# Altium schematic sheet Scratch_Register_16B.SchDoc
size B; Author: E. Sims; Organization: Let's Build Rockets Inc.; SheetNumber: 2; SheetTotal: 2
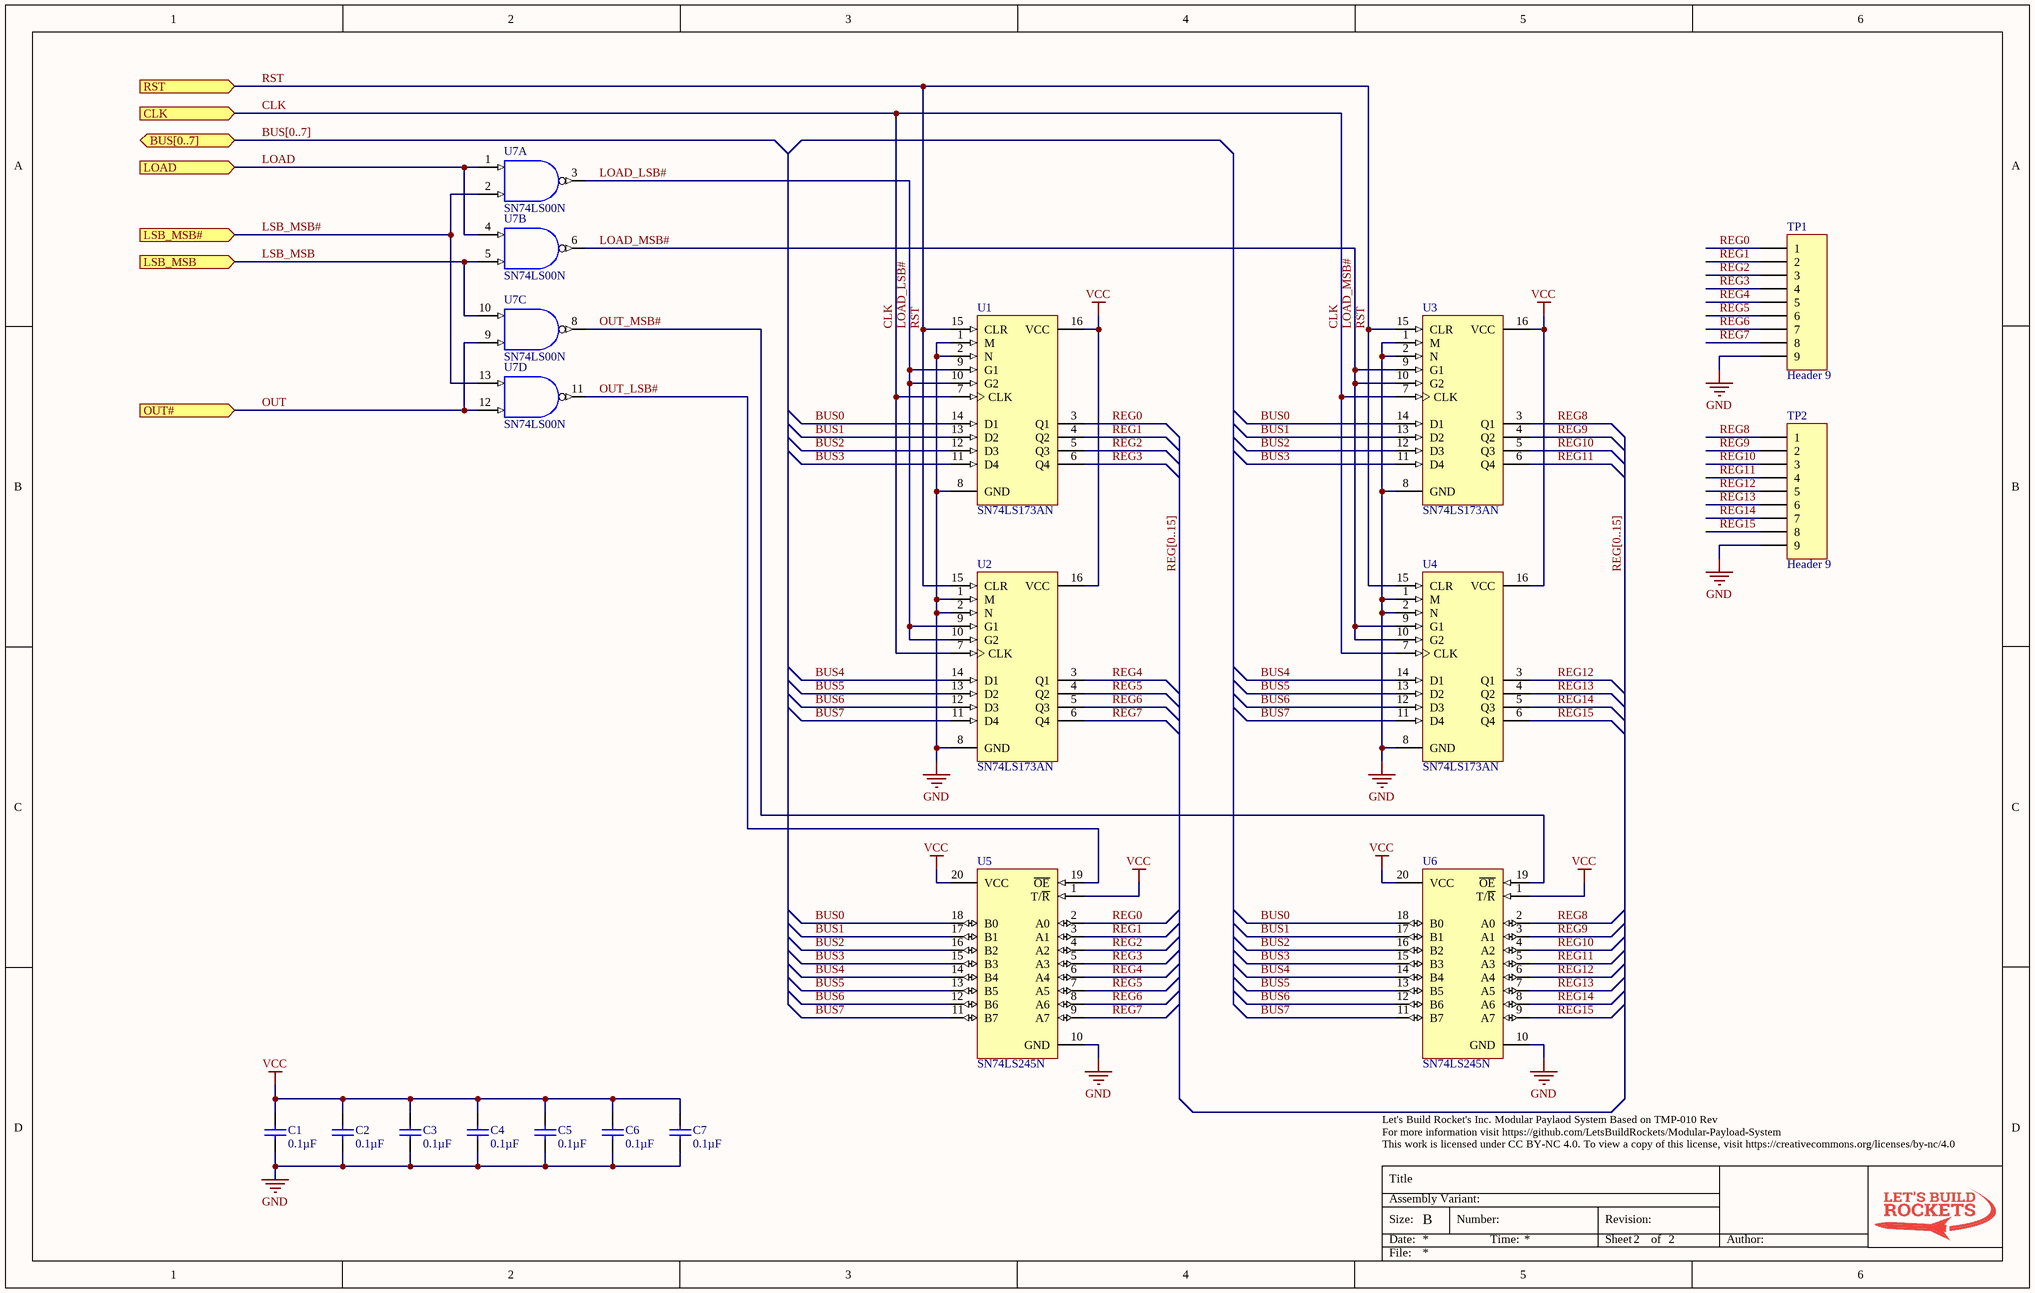
[diagram p0: Scratch_Register_16B.SchDoc]

## Parts
C1  Capacitance: 0.1µF  [VISH-K104K15X7RF5TL2]  (hidden comment: K104K15X7RF5TL2)
C2  Capacitance: 0.1µF  [VISH-K104K15X7RF5TL2]  (hidden comment: K104K15X7RF5TL2)
C3  Capacitance: 0.1µF  [VISH-K104K15X7RF5TL2]  (hidden comment: K104K15X7RF5TL2)
C4  Capacitance: 0.1µF  [VISH-K104K15X7RF5TL2]  (hidden comment: K104K15X7RF5TL2)
C5  Capacitance: 0.1µF  [VISH-K104K15X7RF5TL2]  (hidden comment: K104K15X7RF5TL2)
C6  Capacitance: 0.1µF  [VISH-K104K15X7RF5TL2]  (hidden comment: K104K15X7RF5TL2)
C7  Capacitance: 0.1µF  [VISH-K104K15X7RF5TL2]  (hidden comment: K104K15X7RF5TL2)
TP1  Header 9  [HDR1X9]
TP2  Header 9  [HDR1X9]
U1  SN74LS173AN  [N016D]
U2  SN74LS173AN  [N016D]
U3  SN74LS173AN  [N016D]
U4  SN74LS173AN  [N016D]
U5  SN74LS245N  [N020]
U6  SN74LS245N  [N020]
U7  SN74LS00N  [N014]  (parts A,B,C,D of 4)

## Ports
BUS[0..7] (bidir), CLK (in), LOAD (in), LSB_MSB (in), LSB_MSB# (in), OUT# (in), RST (in)

## Nets
GND: C1.2 C2.2 C3.2 C4.2 C5.2 C6.2 C7.2 TP1.9 TP2.9 U1.1(M) U1.2(N) U1.8(GND) U2.1(M) U2.2(N) U2.8(GND) U3.1(M) U3.2(N) U3.8(GND) U4.1(M) U4.2(N) U4.8(GND) U5.10(GND) U6.10(GND) U7.7(GND)
VCC: C1.1 C2.1 C3.1 C4.1 C5.1 C6.1 C7.1 U1.16(VCC) U2.16(VCC) U3.16(VCC) U4.16(VCC) U5.1(T/~{R}) U5.20(VCC) U6.1(T/~{R}) U6.20(VCC) U7.14(VCC)
BUS0: U1.14(D1) U3.14(D1) U5.18(B0) U6.18(B0)
BUS1: U1.13(D2) U3.13(D2) U5.17(B1) U6.17(B1)
BUS2: U1.12(D3) U3.12(D3) U5.16(B2) U6.16(B2)
BUS3: U1.11(D4) U3.11(D4) U5.15(B3) U6.15(B3)
BUS4: U2.14(D1) U4.14(D1) U5.14(B4) U6.14(B4)
BUS5: U2.13(D2) U4.13(D2) U5.13(B5) U6.13(B5)
BUS6: U2.12(D3) U4.12(D3) U5.12(B6) U6.12(B6)
BUS7: U2.11(D4) U4.11(D4) U5.11(B7) U6.11(B7)
CLK: U1.7(CLK) U2.7(CLK) U3.7(CLK) U4.7(CLK) ; port CLK
LOAD: U7.1(A) U7.4(A) ; port LOAD
LOAD_LSB#: U1.9(G1) U1.10(G2) U2.9(G1) U2.10(G2) U7.3(Y)
LOAD_MSB#: U3.9(G1) U3.10(G2) U4.9(G1) U4.10(G2) U7.6(Y)
LSB_MSB: U7.5(B) U7.10(B) ; port LSB_MSB
LSB_MSB#: U7.2(B) U7.13(B) ; port LSB_MSB#
OUT: U7.9(A) U7.12(A) ; port OUT#
OUT_LSB#: U5.19(~{OE}) U7.11(Y)
OUT_MSB#: U6.19(~{OE}) U7.8(Y)
REG0: TP1.1 U1.3(Q1) U5.2(A0)
REG1: TP1.2 U1.4(Q2) U5.3(A1)
REG2: TP1.3 U1.5(Q3) U5.4(A2)
REG3: TP1.4 U1.6(Q4) U5.5(A3)
REG4: TP1.5 U2.3(Q1) U5.6(A4)
REG5: TP1.6 U2.4(Q2) U5.7(A5)
REG6: TP1.7 U2.5(Q3) U5.8(A6)
REG7: TP1.8 U2.6(Q4) U5.9(A7)
REG8: TP2.1 U3.3(Q1) U6.2(A0)
REG9: TP2.2 U3.4(Q2) U6.3(A1)
REG10: TP2.3 U3.5(Q3) U6.4(A2)
REG11: TP2.4 U3.6(Q4) U6.5(A3)
REG12: TP2.5 U4.3(Q1) U6.6(A4)
REG13: TP2.6 U4.4(Q2) U6.7(A5)
REG14: TP2.7 U4.5(Q3) U6.8(A6)
REG15: TP2.8 U4.6(Q4) U6.9(A7)
RST: U1.15(CLR) U2.15(CLR) U3.15(CLR) U4.15(CLR) ; port RST

## Buses and harness runs
bus BUS[0..7] = port BUS[0..7]
bus REG[0..15]

## Notes on the sheet
- Let's Build Rocket's Inc. Modular Paylaod System Based on TMP-010 Rev
  For more information visit https://github.com/LetsBuildRockets/Modular-Payload-System
  This work is licensed under CC BY-NC 4.0. To view a copy of this license, visit https://creativecommons.org/licenses/by-nc/4.0
- Title
- Size:
- Date:
- Assembly Variant:
- B
- Number:
- Time:
- Revision:
- Sheet
- of
- Author:
- File:

## Library data of the parts
C1-C7 = CMP-2000-06508-1: Ceramic Capacitor, 100 nF, +/- 10%, 50 V, -55 to 125 degC, 2-Pin THD, RoHS, Tape and Reel; Manufacturer: Vishay; Other Names: BC1084CT; Catalog Drawings: Mono-KapSide2-15_5.58Mono-KapSide1_15; Temperature Coefficient: X7R; Voltage - Rated: 50V; Online Catalog: Mono-Kap™Series; Size / Dimension: 0.157"Lx0.098"W(4.00mmx2.50mm); Operating Temperature: -55°C~125°C; Family: CeramicCapacitors; Manufacturer URL: http://www.vishay.com/; Standard Package: 1; Thickness (Max): -; Ratings: -; Datasheet Version: 08/2013; Package Description: 2-Pin Through Hole Device, Body 4 x 2.6 mm; Mounting Type: ThroughHole; Features: -; Lead Spacing: 0.098"(2.50mm); Tolerance: ±10%; Category: Capacitors; Mounting Technology: ThroughHole; Lead Style: Straight; Datasheet URL: http://www.vishay.com/docs/45171/kseries.pdf; Applications: GeneralPurpose; Package / Case: Radial; Height - Seated (Max): 0.220"(5.58mm); Package Reference: K104K15X7RF5TL2; Series: Mono-Kap™K; Packaging: CutTape(CT)
TP1 TP2 = Header 9: Header, 9-Pin; LatestRevisionDate: 17-Jul-2002; LatestRevisionNote: Re-released for DXP Platform.; Publisher: Altium Limited
U1-U4 = SN74LS173AN: 4-Bit D-Type Register with 3-State Outputs; Published: 8-Jun-2000; LatestRevisionDate: 04-Mar-2005; LatestRevisionNote: Stylized 3D Model Added.; DatasheetVersion: Mar-1988; PackageVersion: Oct-1995; PackageReference: N016D; Publisher: Altium Limited; PackageDescription: DIP; 16 Leads; Row Spacing 7.62 mm; Pitch 2.54 mm; Code_JEDEC: MS-001-BB; ComponentLink1Description: Manufacturer Link; ComponentLink1URL: http://www.ti.com/; ComponentLink2Description: Datasheet; ComponentLink2URL: http://www-s.ti.com/sc/ds/sn74ls173a.pdf
U5 U6 = SN74LS245N: Octal Bus Transceiver with 3-State Outputs; Published: 8-Jun-2000; LatestRevisionDate: 04-Mar-2005; LatestRevisionNote: Stylized 3D Model Added.; DatasheetVersion: Mar-1988; PackageVersion: Oct-1995; PackageReference: N020; Publisher: Altium Limited; PackageDescription: DIP; 20 Leads; Row Spacing 7.62 mm; Pitch 2.54 mm; ComponentLink1Description: Manufacturer Link; ComponentLink1URL: http://www.ti.com/; ComponentLink2Description: Datasheet; ComponentLink2URL: http://www-s.ti.com/sc/ds/sn74ls245.pdf
U7 = SN74LS00N: Quadruple 2-Input Positive-NAND Gate; Published: 8-Jun-2000; LatestRevisionDate: 04-Mar-2005; LatestRevisionNote: Stylized 3D Model Added.; DatasheetVersion: Mar-1988; PackageVersion: Oct-1995; PackageReference: N014; Publisher: Altium Limited; PackageDescription: DIP; 14 Leads; Row Spacing 7.62 mm; Pitch 2.54 mm; ComponentLink1Description: Manufacturer Link; ComponentLink1URL: http://www.ti.com/; ComponentLink2Description: Datasheet; ComponentLink2URL: http://www-s.ti.com/sc/ds/sn74ls00.pdf